# Altium schematic sheet 05_IMU.SchDoc: Wearable Ultra Low-Power Ultrasound probe
size A3; DrawnBy: Sebastian Frey; Organization: Integrated Systems Laboratory; Revision: v1.0; SheetNumber: 6; SheetTotal: 6
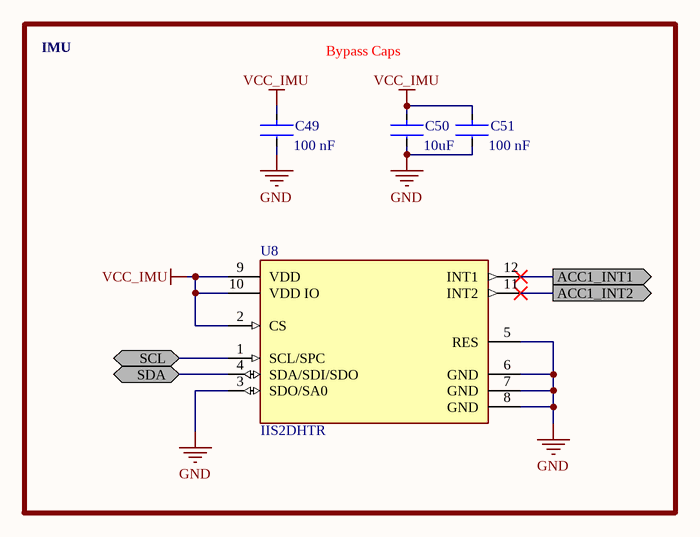
[diagram p0: 05_IMU.SchDoc]

## Parts
C49  value 100 nF  [FP-CC0402-MFG]  (hidden comment: CC0402KRX7R7BB104)
C50  value 10uF  [FP-C1608-080-MFG]  (hidden comment: C1608X5R1A106K080AC)
C51  value 100 nF  [FP-CC0402-MFG]  (hidden comment: CC0402KRX7R7BB104)
U8  IIS2DHTR  [FP-LGA-12-8365767-MFG]

## Blocks framed on the sheet
IMU: C49-C51 U8

## Ports
ACC1_INT1 (out), ACC1_INT2 (out), SCL (bidir), SDA (bidir)

## Nets
GND: C49.2 C50.2 C51.2 U8.3(SDO/SA0) U8.5(RES) U8.6(GND) U8.7(GND) U8.8(GND)
VCC_IMU: C49.1 C50.1 C51.1 U8.2(CS) U8.9(VDD) U8.10(VDD_IO)
ACC1_INT1: U8.12(INT1) ; port ACC1_INT1
ACC1_INT2: U8.11(INT2) ; port ACC1_INT2
SCL: U8.1(SCL/SPC) ; port SCL
SDA: U8.4(SDA/SDI/SDO) ; port SDA

## Notes on the sheet
- Bypass Caps
- 1
- 2
- 3
- 4
- 5
- 6
- 7
- 8
- A
- B
- C
- D
- Project:
- Date:
- Drawing number:
- Rev:
- Format:
- A3
- Drawn by:
- Laboratory:
- Page
- Sheet:
- of
- File:

## Library data of the parts
C49 C51 = CMP-03422-000048-1: CAP CER 0.1UF 16V X7R 0402; Manufacturer: YAGEO; Material: Ceramic; Automotive Grade: NA; Temperature Coefficient: 30ppm/°C; Tolerance: 0.1; Device Class L1: Passive Components; Temperature Range Low: -55°C; Device Class L3: Ceramic Capacitors; Temperature Characteristic: X7R; Ipc Land Pattern Name: CAPC10050X50; Capacitance: 100 nF; Temperature Range High: +125°C; Voltage Rating: 16 V; Temperature: -55°C to +125°C; RoHS: TRUE; Automotive: No; Height: 0.55mm; Device Class L2: Capacitors; Digikey Description: CAP CER 0.1UF 16V X7R 0402; Package: CC0402; Footprint Url: http://www.yageo.com/exep/pages/download/literatures/UPY-C_GEN_24.pdf; ComponentLink2Description: Datasheet; Category: Cap; Lead Free: Yes; Octopart: https://octopart.com/cc0402krx7r7bb104-yageo-42244624; ComponentLink2URL: http://www.yageo.com/documents/recent/UPY-GP_NP0_16V-to-50V_16.pdf; Manufacturer Part Number: CC0402KRX7R7BB104; Mouser Description: 0402 0.1 uF 16 V ±10 % Tolerance X7R SMT Multilayer Ceramic Capacitor
C50 = CMP-2000-04979-2: CAP CER 10UF 10V X5R 0603; Manufacturer: TDK; Temperature Coefficient: 15%; Tolerance: 10%; Material: Ceramic; Mouser Description: CAP CER 10UF 10V X5R 0603; Package: C1608-080; Lead Free: Yes; Device Class L1: Passive Components; Temperature Range High: +85°C; Manufacturer Part Number: C1608X5R1A106K080AC; Octopart: https://octopart.com/c1608x5r1a106k080ac-tdk-26013468; Voltage: 10V; Footprint Url: https://product.tdk.com/info/en/catalog/spec/mlccspec_commercial_general_midvoltage_en.pdf; Ipc Land Pattern Name: CAPC16080X80; Temperature Range Low: -55°C; Temperature: -55°C to +85°C; ComponentLink2Description: Datasheet; ComponentLink2URL: https://product.tdk.com/info/en/documents/chara_sheet/C1608X5R1A106K080AC.pdf; Height: 0.9mm; Temperature Characteristic: X5R; RoHS: TRUE; Category: Cap; Capacitance: 10uF; Digikey Description: CAP CER 10UF 10V X5R 0603; Automotive: No; Device Class L3: Ceramic Capacitors; Device Class L2: Capacitors; Voltage Rating: 10V
U8 = CMP-12175-000008-1: ACCEL 2-16G I2C/SPI 12LGA; Manufacturer: STMicroelectronics; Operating Supply Current: 2-11uA; Max Supply Voltage: 3.7V; Accel Axis: X+Y and Z; Sensor Output: I2C,SPI; Min Supply Voltage: 1.71V; Accel Range: 2/4/8/16g; Height: 1mm; Device Class L1: Sensors; Manufacturer Part Number: IIS2DHTR; Temperature Range High: +85°C; ComponentLink2Description: Datasheet; Automotive: No; Temperature Range Low: -40°C; Package: LGA-12-8365767; Octopart: https://octopart.com/iis2dhtr-stmicroelectronics-58218805; Digikey Description: ACCEL 2-16G I2C/SPI 12LGA; ComponentLink2URL: https://www.st.com/content/ccc/resource/technical/document/datasheet/group1/35/6d/04/26/27/5c/4d/7c/DM00171283/files/DM00171283.pdf/jcr:content/translations/en.DM00171283.pdf; Temperature: -40°C to +85°C; Category: IC; RoHS: TRUE; Device Class L3: Accelerometers; Lead Free: Yes; Device Class L2: Motion Sensors